# Altium schematic sheet Series2.SchDoc
size 1651 x 1651 mm
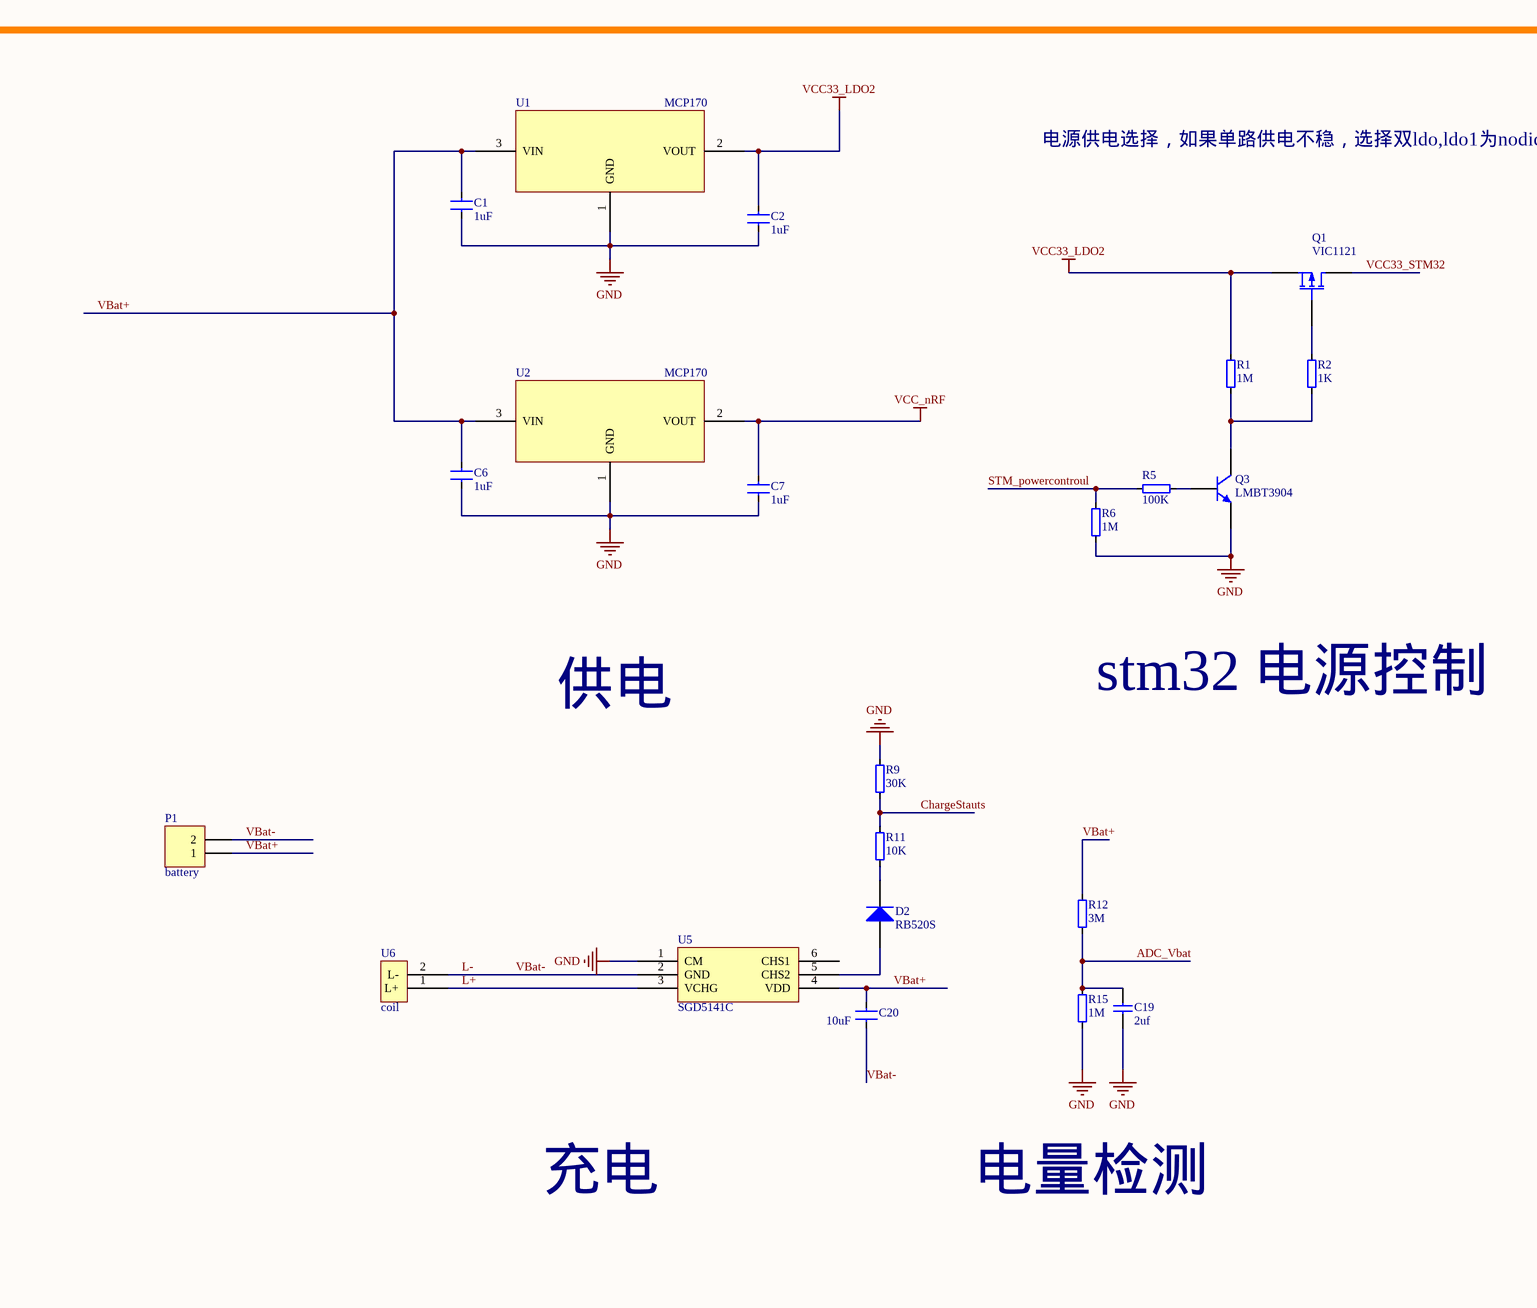
[diagram p0: Series2.SchDoc, top left]
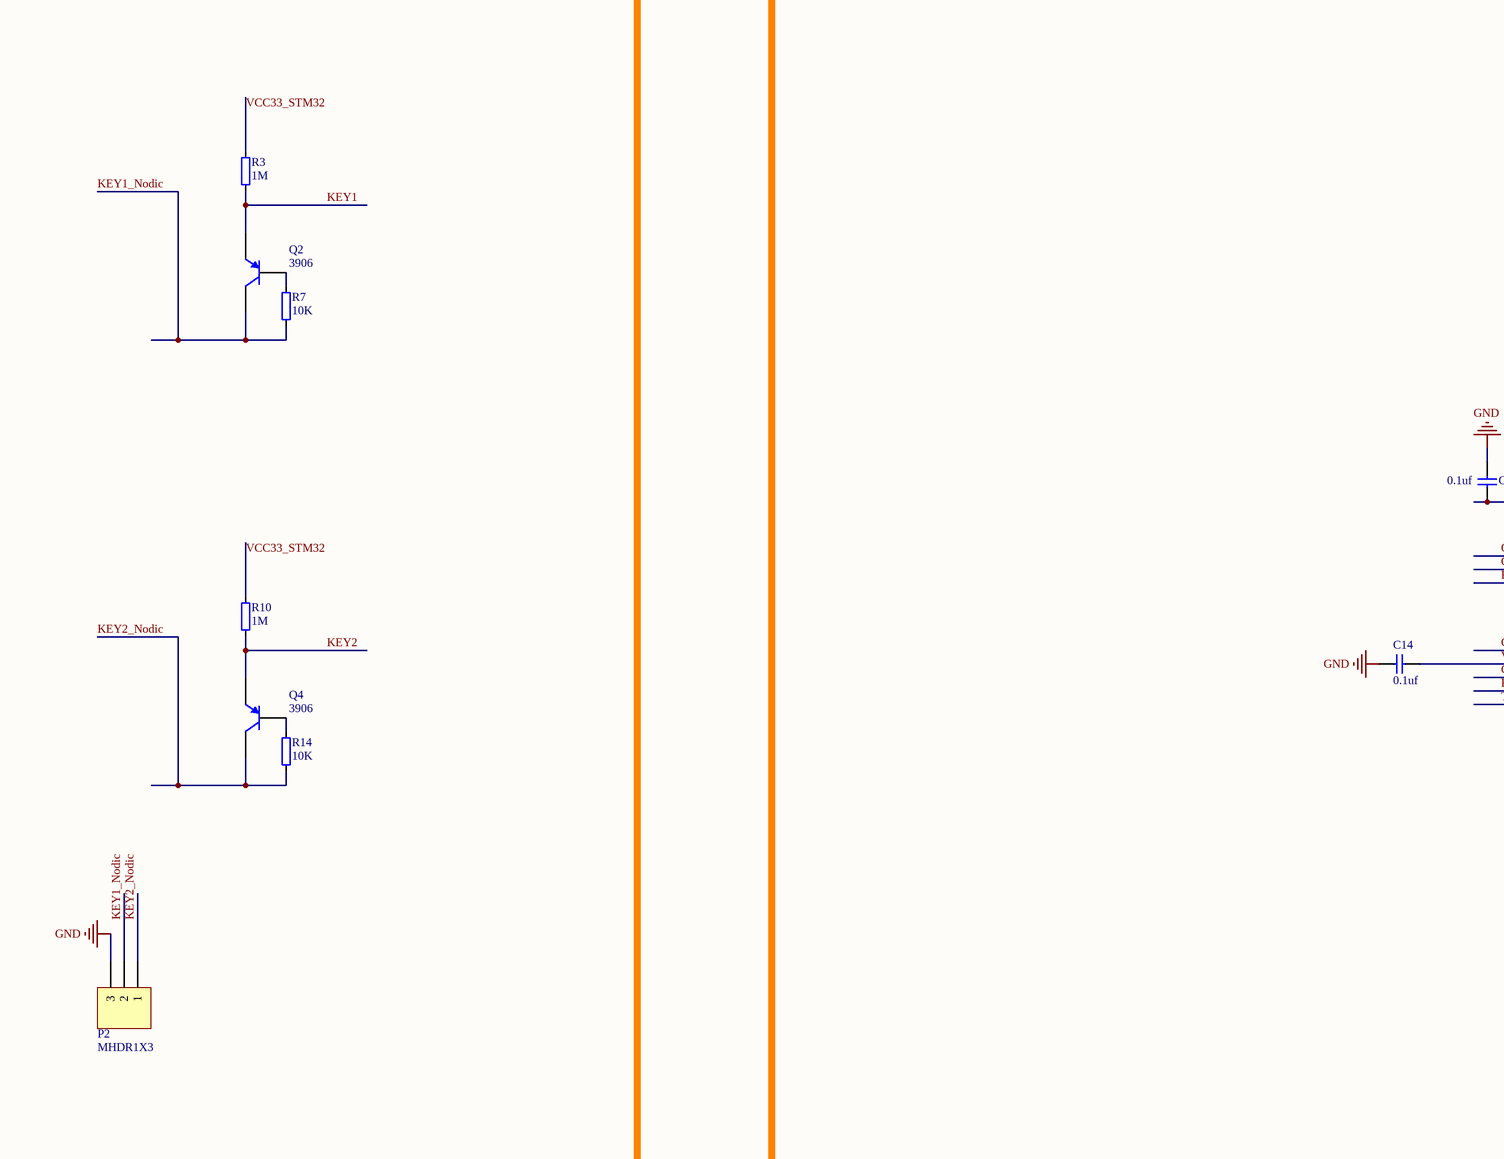
[diagram p1: Series2.SchDoc, top middle]
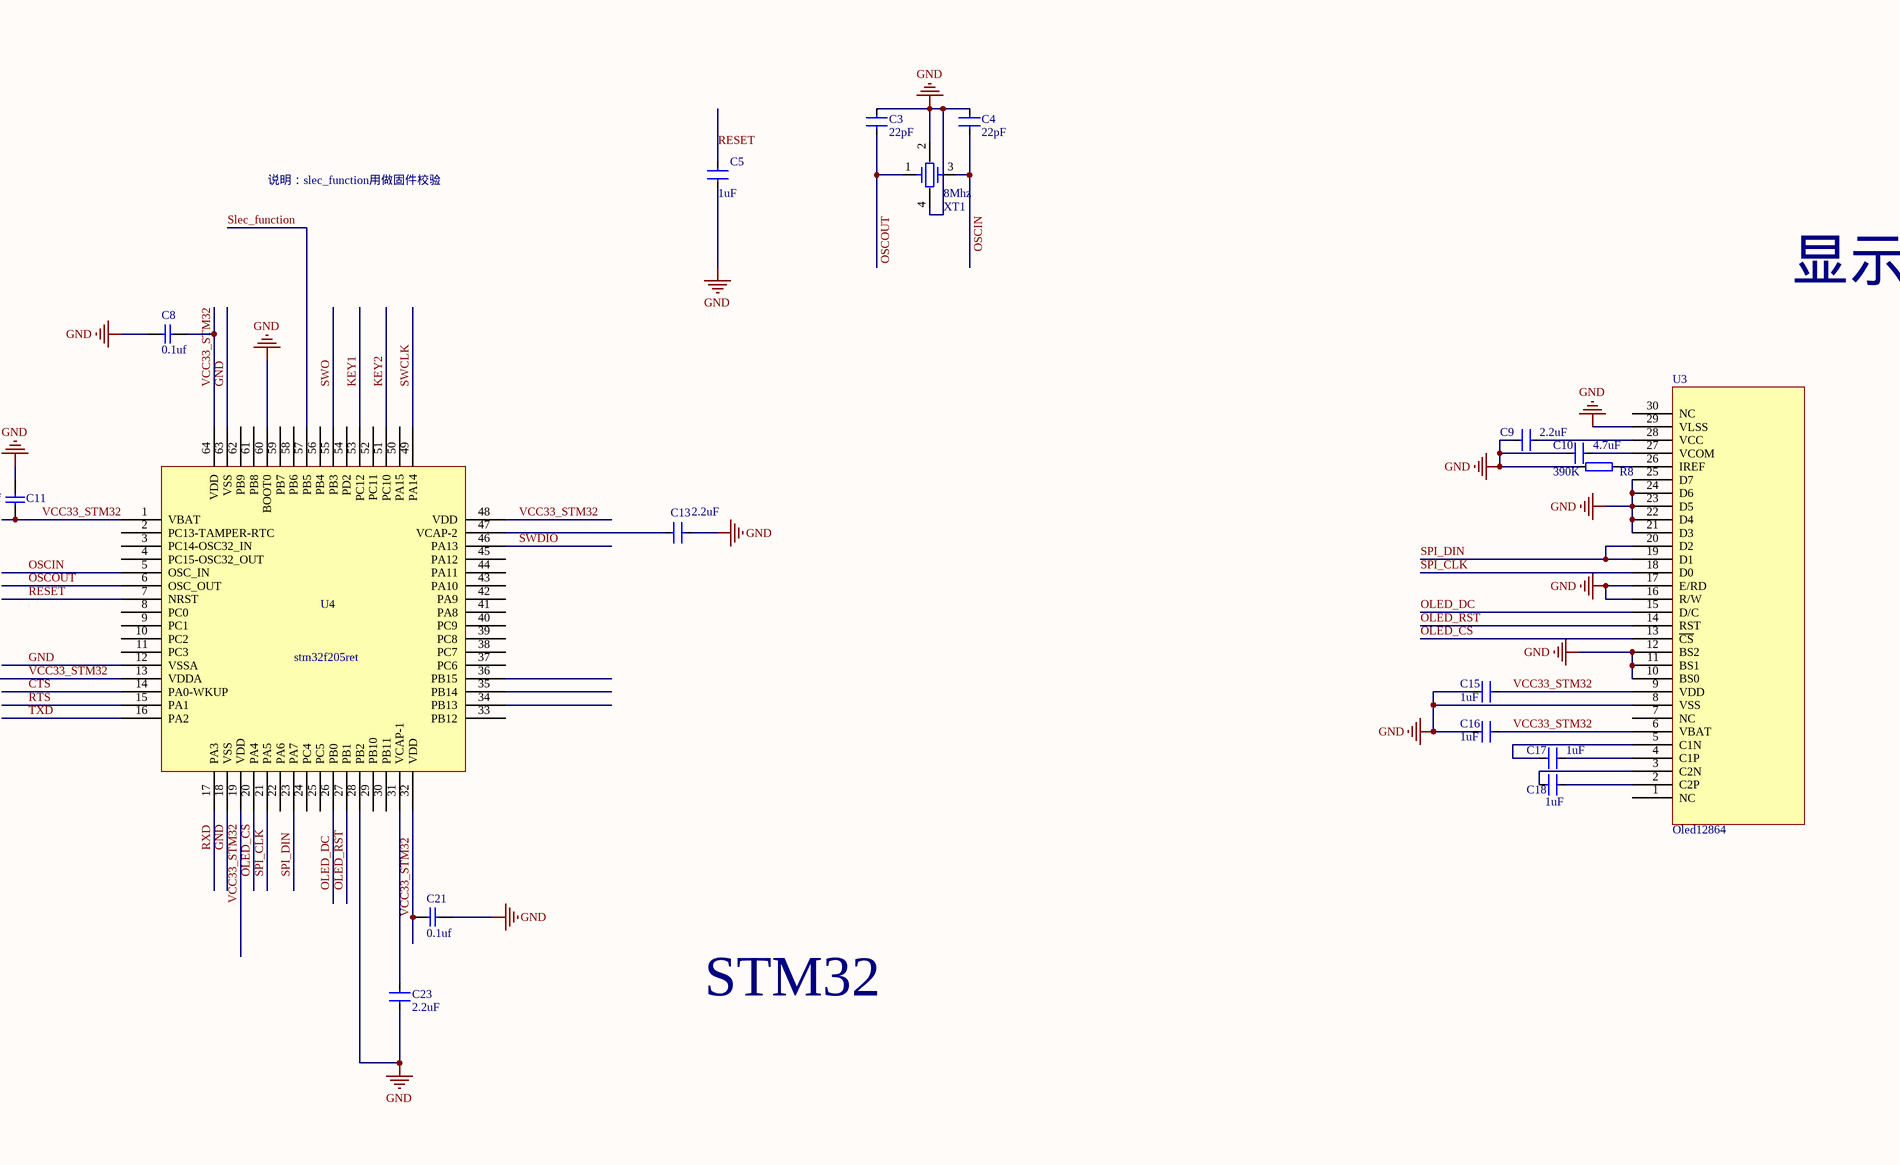
[diagram p2: Series2.SchDoc, top right]
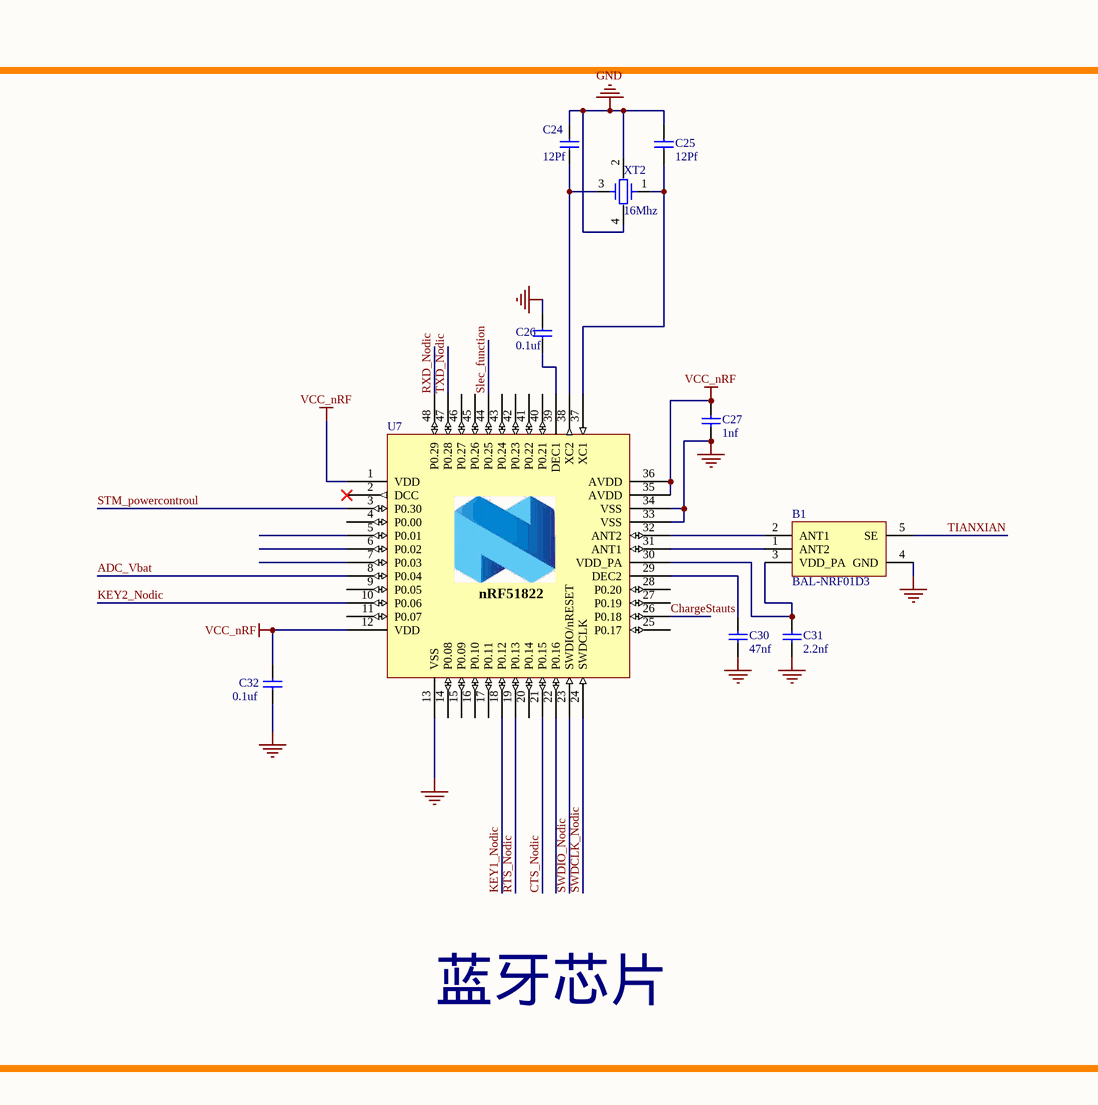
[diagram p3: Series2.SchDoc, bottom left]
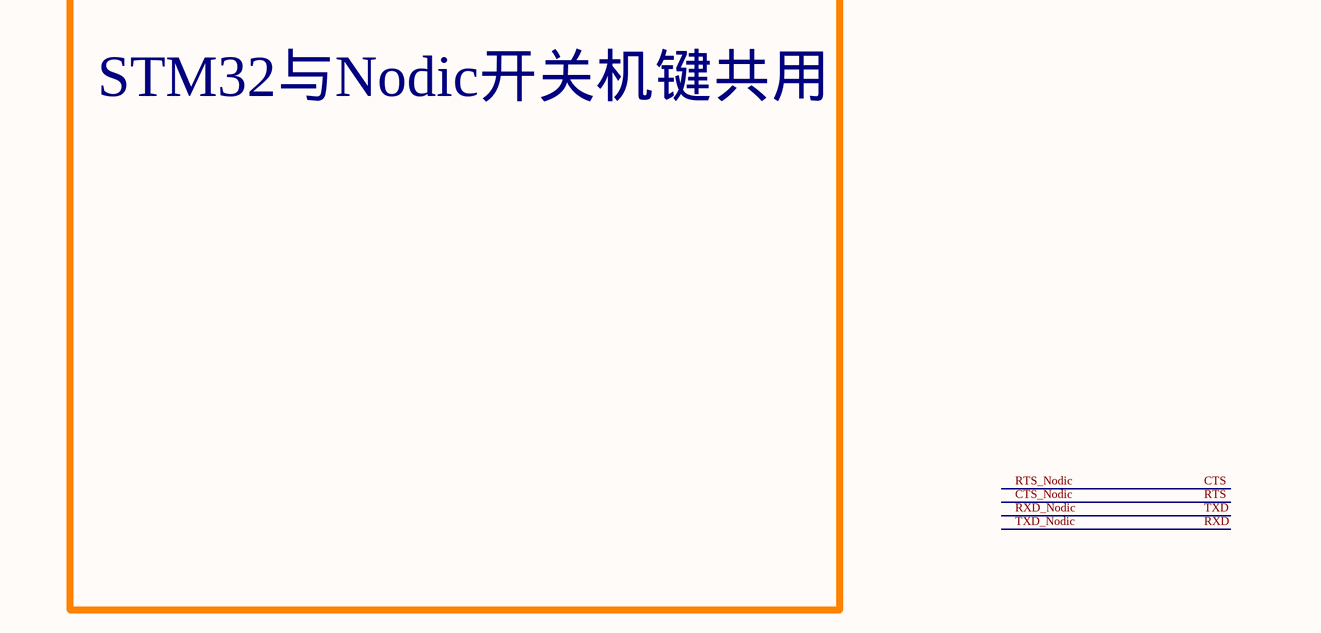
[diagram p4: Series2.SchDoc, bottom middle]

## Parts
B1  BAL-NRF01D3  [BAL-NRF01D3]
C1  1uF  [0402-a]
C2  1uF  [0402-a]
C3  22pF  [0402-A]
C4  22pF  [0402-a]
C5  1uF  [0402-a]
C6  1uF  [0402-a]
C7  1uF  [0402-a]
C8  0.1uf  [0402-A]
C9  2.2uF  [0402-a]
C10  4.7uF  [0402-a]
C11  0.1uf  [0402-A]
C13  2.2uF  [0402-a]
C14  0.1uf  [0402-A]
C15  1uF  [0402-a]
C16  1uF  [0402-a]
C17  1uF  [0402-a]
C18  1uF  [0402-a]
C19  2uf  [0402-a]
C20  10uF  [0603-1]
C21  0.1uf  [0402-A]
C23  2.2uF  [0402-a]
C24  12Pf  [0402-a]
C25  12Pf  [0402-a]
C26  0.1uf  [0402-A]
C27  1nf  [0402-a]
C30  47nf  [0402-A]
C31  2.2nf  [0402-A]
C32  0.1uf  [0402-A]
D2  RB520S  [sod523]
P1  battery  [HDR1X2]
P2  MHDR1X3  [BUTTONAPPLE]
Q1  VIC1121  [SOT-23]
Q2  3906  [SOT523]
Q3  LMBT3904  [SOT523]
Q4  3906  [SOT523]
R1  1M  [0402-A]
R2  1K  [0402-A]
R3  1M  [0402-A]
R5  100K  [0402-A]
R6  1M  [0402-A]
R7  10K  [0402-A]
R8  390K  [0402-A]
R9  30K  [0402-A]
R10  1M  [0402-A]
R11  10K  [0402-A]
R12  3M  [0402-A]
R14  10K  [0402-A]
R15  1M  [0402-A]
U1  MCP170  [SOT-23]
U2  MCP170  [SOT-23]
U3  Oled12864  [oled12864]
U4  stm32f205ret  [LQFP-64]
U5  SGD5141C  [sot23-6]
U6  coil  [coil]
U7  nRF51822-QFAA  [QFN40P600X600X90-48N]  (value not drawn)
XT1  8Mhz  [SMD3225]
XT2  16Mhz  [SMD3225]

## Blocks framed on the sheet
STM32与Nodic开关机键共用: P2 Q2 Q4 R3 R7 R10 R14
蓝牙芯片: B1 C24-C27 C30-C32 U7 XT2

## Nets
GND: B1.4(GND) C1.2 C2.2 C3.1 C4.1 C5.2 C6.2 C7.2 C8.1 C9.2 C10.2 C11.2 C13.2 C14.2 C15.2 C16.2 C19.1 C21.1 C23.2 C24.2 C25.2 C26.1 C27.1 C30.1 C31.1 C32.1 P2.3 Q3.2(E) R6.1 R8.1 R9.2 R15.1 U1.1(GND) U2.1(GND) U3.8(VSS) U3.10(BS0) U3.11(BS1) U3.12(BS2) U3.16(R/W) U3.17(E/RD) U3.21(D3) U3.22(D4) U3.23(D5) U3.24(D6) U3.25(D7) U3.29(VLSS) U4.12(VSSA) U4.18(VSS) U4.28(PB2) U4.60(BOOT0) U4.63(VSS) U5.1(CM) U7.13(VSS) U7.33(VSS) U7.34(VSS) U7.49 XT1.2 XT1.4 XT2.2 XT2.4
VCC33_LDO2: C2.1 Q1.2(S) R1.2 U1.2(VOUT)
VCC_nRF: C7.1 C27.2 C32.2 U2.2(VOUT) U7.1(VDD) U7.12(VDD) U7.35(AVDD) U7.36(AVDD)
ADC_Vbat: C19.2 R12.1 R15.2 U7.8(P0.04)
ChargeStauts: R9.1 R11.2 U7.26(P0.18)
CTS: U4.14(PA0-WKUP) U7.19(P0.13)  [also labelled RTS_Nodic]
CTS_Nodic: U4.15(PA1) U7.21(P0.15)  [also labelled RTS]
KEY1: Q2.2(E) R3.1 U4.53(PC12)
KEY1_Nodic: P2.2 Q2.3(C) R7.1 U7.18(P0.12)
KEY2: Q4.2(E) R10.1 U4.51(PC10)
KEY2_Nodic: P2.1 Q4.3(C) R14.1 U7.10(P0.06)
L+: U5.3(VCHG) U6.1(L+)
L-: C20.2 P1.2 U5.2(GND) U6.2(L-)  [also labelled VBat-]
OLED_CS: U3.13(~{CS}) U4.20(PA4)
OLED_DC: U3.15(D/C) U4.26(PB0)
OLED_RST: U3.14(RST) U4.27(PB1)
OSCIN: C4.2 U4.5(OSC_IN) XT1.3
OSCOUT: C3.2 U4.6(OSC_OUT) XT1.1
RESET: C5.1 U4.7(NRST)
RXD: U4.17(PA3) U7.47(P0.28)  [also labelled TXD_Nodic]
RXD_Nodic: U4.16(PA2) U7.48(P0.29)  [also labelled TXD]
Slec_function: U4.57(PB5) U7.44(P0.25)
SPI_CLK: U3.18(D0) U4.21(PA5)
SPI_DIN: U3.19(D1) U3.20(D2) U4.23(PA7)
STM_powercontroul: R5.2 R6.2 U7.3(P0.30)
SWCLK: U4.49(PA14)
SWDCLK_Nodic: U7.24(SWDCLK)
SWDIO: U4.46(PA13)
SWDIO_Nodic: U7.23(SWDIO/nRESET)
SWO: U4.55(PB3)
TIANXIAN: B1.5(SE)
VBat+: C1.1 C6.1 C20.1 P1.1 R12.2 U1.3(VIN) U2.3(VIN) U5.4(VDD)
VCC33_STM32: C8.2 C11.1 C14.1 C15.1 C16.1 C21.2 Q1.3(D) R3.2 R10.2 U3.6(VBAT) U3.9(VDD) U4.1(VBAT) U4.13(VDDA) U4.19(VDD) U4.32(VDD) U4.48(VDD) U4.64(VDD)
NetB1_1: B1.1(ANT2) U7.31(ANT1)
NetB1_2: B1.2(ANT1) U7.32(ANT2)
NetB1_3: B1.3(VDD_PA) C31.2 U7.30(VDD_PA)
NetC9_1: C9.1 U3.28(VCC)
NetC10_1: C10.1 U3.27(VCOM)
NetC13_1: C13.1 U4.47(VCAP-2)
NetC17_1: C17.1 U3.4(C1P)
NetC17_2: C17.2 U3.5(C1N)
NetC18_1: C18.1 U3.2(C2P)
NetC18_2: C18.2 U3.3(C2N)
NetC23_1: C23.1 U4.31(VCAP-1)
NetC24_1: C24.1 U7.38(XC2) XT2.3
NetC25_1: C25.1 U7.37(XC1) XT2.1
NetC26_2: C26.2 U7.39(DEC1)
NetC30_2: C30.2 U7.29(DEC2)
NetD2_1: D2.1(A) U5.5(CHS2)
NetD2_2: D2.2(K) R11.1
NetQ1_1: Q1.1(G) R2.2
NetQ2_1: Q2.1(B) R7.2
NetQ3_1: Q3.1(B) R5.1
NetQ3_3: Q3.3(C) R1.1 R2.1
NetQ4_1: Q4.1(B) R14.2
NetR8_2: R8.2 U3.26(IREF)

Not connected (* = marked no-connect by the designer): U3 1(NC) 7(NC) 30(NC); U4 2(PC13-TAMPER-RTC) 3(PC14-OSC32_IN) 4(PC15-OSC32_OUT) 8(PC0) 9(PC1) 10(PC2) 11(PC3) 22(PA6) 24(PC4) 25(PC5) 29(PB10) 30(PB11) 33(PB12) 34(PB13) 35(PB14) 36(PB15) 37(PC6) 38(PC7) 39(PC8) 40(PC9) 41(PA8) 42(PA9) 43(PA10) 44(PA11) 45(PA12) 50(PA15) 52(PC11) 54(PD2) 56(PB4) 58(PB6) 59(PB7) 61(PB8) 62(PB9); U5 6(CHS1); U7 2(DCC)* 4(P0.00) 5(P0.01) 6(P0.02) 7(P0.03) 9(P0.05) 11(P0.07) 14(P0.08) 15(P0.09) 16(P0.10) 17(P0.11) 20(P0.14) 22(P0.16) 25(P0.17) 27(P0.19) 28(P0.20) 40(P0.21) 41(P0.22) 42(P0.23) 43(P0.24) 45(P0.26) 46(P0.27)

## Notes on the sheet
- 电源供电选择，如果单路供电不稳，选择双ldo,ldo1为nodic供电
- 说明：slec_function用做固件校验
- 显示
- 供电
- stm32 电源控制
- 充电
- 电量检测
- STM32
- (in symbol nRF51822-Q48-6x6_DCDC) nRF51822

## Library data of the parts
B1 = BAL-NRF01D3: ST BAL-NRF01D3; Artikkelnr Noca: N.A.; Part Number: BAL-NRF01D3; Manufacturer: ST; Manufacturer Part Number: BAL-NRF01D3; Datasheet: *; LatestRevisionDate: 2013-01-07; Pin Count: 5; Publisher: Nordic Semiconductor; Published: 2009-01-13; Value: BAL-NRF01D3; Note: BAL-NRF01D3; Supplier: *; Supplier part number: *; 2nd source Supplier: *; 2nd source part number: *
C1-C7 C9 C10 C13 C15-C18 C20 C23 = CAP-0.1UF: SMD-CAP
C8 C11 C14 C21 = CAP: Capacitor, X7R, ?0%; Part Number: C0402-100n; Value: 100nF; Note: 16V; Artikkelnr Noca: 20039200; Manufacturer: *; Manufacturer Part Number: *; Datasheet: *; Footprint: 0402; LatestRevisionDate: 2009-11-23; Pin Count: 2; Publisher: Nordic Semiconductor; Published: 2009-05-08; Supplier: *; Supplier part number: *; 2nd source Supplier: *; 2nd source part number: *
C19 C26 C32 = C0402-100n: Capacitor, X7R, ?0%; Value: 100nF; Note: 16V; Artikkelnr Noca: 20039200; Part Number: C0402-100n; Manufacturer: *; Manufacturer Part Number: *; Datasheet: *; Footprint: 0402; LatestRevisionDate: 2009-11-23; Pin Count: 2; Publisher: Nordic Semiconductor; Published: 2009-05-08; Supplier: *; Supplier part number: *; 2nd source Supplier: *; 2nd source part number: *
C24 C25 = C0402-12p: Capacitor, NP0, ?%; Note: 50V; Artikkelnr Noca: 20029159; Part Number: C0402-12p; Manufacturer: *; Manufacturer Part Number: *; Datasheet: *; Footprint: 0402; LatestRevisionDate: 2011-05-11; Pin Count: 2; Publisher: Nordic Semiconductor; Published: 2009-05-08; Value: 12pF; Supplier: *; Supplier part number: *; 2nd source Supplier: *; 2nd source part number: *
C27 = C0402-1n0: Capacitor, X7R, ?0%; Value: 1.0nF; Note: 50V; Artikkelnr Noca: 20039223; Part Number: C0402-1n0; Manufacturer: *; Manufacturer Part Number: *; Datasheet: *; Footprint: 0402; LatestRevisionDate: 2009-11-23; Pin Count: 2; Publisher: Nordic Semiconductor; Published: 2009-05-08; Supplier: *; Supplier part number: *; 2nd source Supplier: *; 2nd source part number: *
C30 = C0402-47n: Capacitor, X7R, ?0%; Note: Chip Cap 10%; Artikkelnr Noca: 20039389; Part Number: C0402-47n; Manufacturer: *; Manufacturer Part Number: *; Datasheet: *; Footprint: 0402; LatestRevisionDate: 2009-05-08; Pin Count: 2; Publisher: Nordic Semiconductor; Published: 2009-05-08; Value: 47nF; Supplier: *; Supplier part number: *; 2nd source Supplier: *; 2nd source part number: *
C31 = C0402-2n2: Capacitor, X7R, ?0%; Note: 50V; Artikkelnr Noca: 20039221; Part Number: C0402-2n2; Manufacturer: *; Manufacturer Part Number: *; Datasheet: *; Footprint: 0402; LatestRevisionDate: 2009-11-23; Pin Count: 2; Publisher: Nordic Semiconductor; Published: 2009-05-08; Value: 2.2nF; Supplier: *; Supplier part number: *; 2nd source Supplier: *; 2nd source part number: *
D2 = Diode: Default Diode; Published: 8-Jun-2000; LatestRevisionDate: 17-Jul-2002; LatestRevisionNote: Re-released for DXP Platform.; PackageDocument: Sep-1996; PackageReference: SMC; Publisher: Altium Limited; Code_JEDEC: DO-214-AB
P1 = Header 2: Header, 2-Pin; LatestRevisionDate: 17-Jul-2002; LatestRevisionNote: Re-released for DXP Platform.; Publisher: Altium Limited
P2 = MHDR1X3: Header, 3-Pin; LatestRevisionDate: 17-Jul-2002; LatestRevisionNote: Re-released for DXP Platform.; Publisher: Altium Limited
Q1 = MOSFET-P: P-Channel MOSFET; PackageDocument: 1995/1996; Published: 8-Jun-2000; LatestRevisionDate: 17-Jul-2002; LatestRevisionNote: Re-released for DXP Platform.; PackageReference: E3; Publisher: Altium Limited
Q2 Q4 = 2N3906: PNP General Purpose Amplifier; Published: 8-Jun-2000; LatestRevisionDate: 15-Jan-2003; LatestRevisionNote: PCB Footprint 'BCY-W3/D4.7' replaced; DatasheetDocument: 1997; PackageDocument: Sep-1998; PackageReference: TO-92A; Publisher: Altium Limited; Code_JEDEC: TO-92A; ComponentLink1Description: Manufacturer Link; ComponentLink1URL: http://www.fairchildsemi.com/; ComponentLink2Description: Datasheet; ComponentLink2URL: http://www.fairchildsemi.com/ds/2N%2F2N3906.pdf
Q3 = 2N3904: NPN General Purpose Amplifier; Published: 8-Jun-2000; LatestRevisionDate: 15-Jan-2003; LatestRevisionNote: PCB Footprint 'BCY-W3/D4.7' replaced; DatasheetDocument: 1997; PackageDocument: Sep-1998; PackageReference: TO-92A; Publisher: Altium Limited; Code_JEDEC: TO-92A; ComponentLink1Description: Manufacturer Link; ComponentLink1URL: http://www.fairchildsemi.com/; ComponentLink2Description: Datasheet; ComponentLink2URL: http://www.fairchildsemi.com/ds/2N%2F2N3904.pdf
R1-R3 R5-R12 R14 R15 = R-10K: resistor
U7 = nRF51822-Q48-6x6_DCDC: Multi-protocol Bluetooth Low Energy and 2.4GHz proprietary system-on-chip; Manufacturer: Nordic Semiconductor; Note: nRF51822 - QFN48 6x6 0.4mm pitch; Artikkelnr Noca: 15079200; Part Number: nRF51822-Q48-6x6_DCDC; Manufacturer Part Number: nRF51822-QFAA; Datasheet: *; Footprint: QFN-48; LatestRevisionDate: 2012-07-10; Pin Count: 48; Publisher: Nordic Semiconductor; Published: 2012-07-08; Value: nRF51822-QFAA; Supplier: Nordic Semiconductor; Supplier part number: *; 2nd source Supplier: *; 2nd source part number: *
XT1 XT2 = XT: 晶振